# EAGLE design 7474-strobe-generator-v2 (EAGLE 9.4.2)
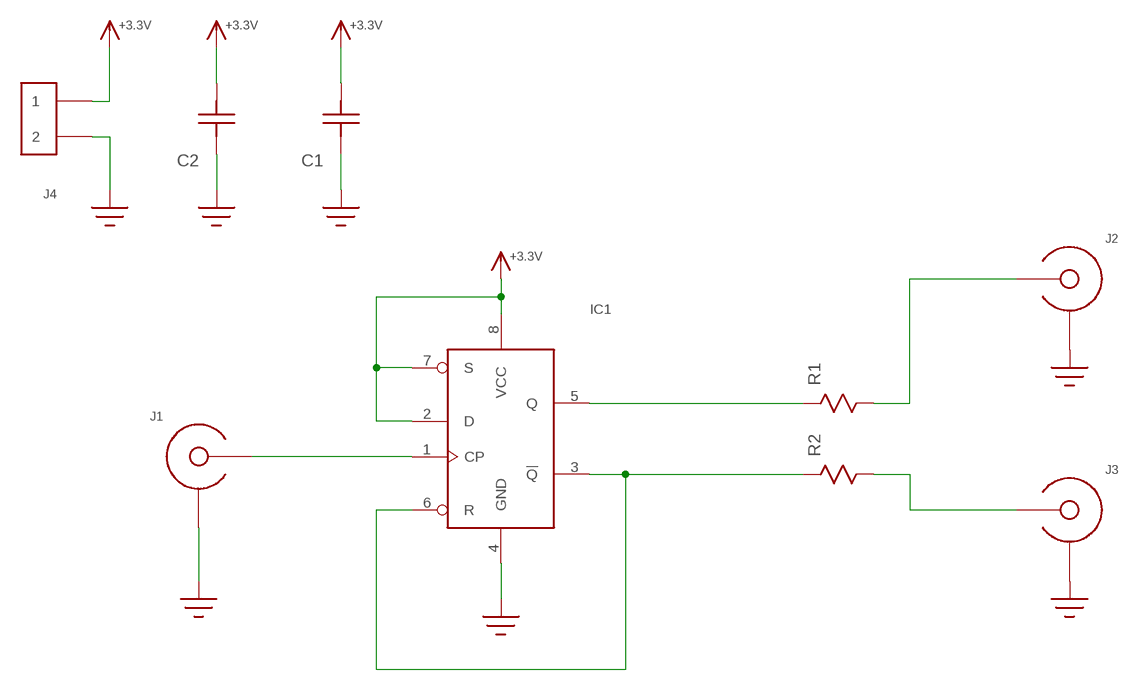
[diagram p0: schematic, sheet 1]

## Parts
C1  C0603  [C0603]
C2  C1206  [1206]
IC1  74LVC2G74  [SSOP8]
J1  SMA-EDGE-LAUNCH4020_TAPER  [SMA_EDGE_LAUNCH_2L_4020_TAPER]
J2  SMA-EDGE-LAUNCH4020_TAPER  [SMA_EDGE_LAUNCH_2L_4020_TAPER]
J3  SMA-EDGE-LAUNCH4020_TAPER  [SMA_EDGE_LAUNCH_2L_4020_TAPER]
J4  HEADER_2PIN  [HEADER_2PIN]
R1  R0603  [R0603]
R2  R0603  [R0603]

## Nets
+3.3V: C1.P$1 C2.P$1 IC1.2(D) IC1.7(S) IC1.8(VCC) J4.1
GND: C1.P$2 C2.P$2 IC1.4(GND) J1.BOTTOM_GND(SHIELD) J1.GND@1(SHIELD) J1.GND@2(SHIELD) J1.GND@3(SHIELD) J1.GND@4(SHIELD) J1.GND@5(SHIELD) J1.GND@6(SHIELD) J1.GND@7(SHIELD) J1.GND@8(SHIELD) J1.GND@14(SHIELD) J1.GND@15(SHIELD) J1.GND@16(SHIELD) J1.GND@17(SHIELD) J1.GND_PAD1(SHIELD) J1.GND_PAD2(SHIELD) J1.P$1(SHIELD) J1.P$2(SHIELD) J2.BOTTOM_GND(SHIELD) J2.GND@1(SHIELD) J2.GND@2(SHIELD) J2.GND@3(SHIELD) J2.GND@4(SHIELD) J2.GND@5(SHIELD) J2.GND@6(SHIELD) J2.GND@7(SHIELD) J2.GND@8(SHIELD) J2.GND@14(SHIELD) J2.GND@15(SHIELD) J2.GND@16(SHIELD) J2.GND@17(SHIELD) J2.GND_PAD1(SHIELD) J2.GND_PAD2(SHIELD) J2.P$1(SHIELD) J2.P$2(SHIELD) J3.BOTTOM_GND(SHIELD) J3.GND@1(SHIELD) J3.GND@2(SHIELD) J3.GND@3(SHIELD) J3.GND@4(SHIELD) J3.GND@5(SHIELD) J3.GND@6(SHIELD) J3.GND@7(SHIELD) J3.GND@8(SHIELD) J3.GND@14(SHIELD) J3.GND@15(SHIELD) J3.GND@16(SHIELD) J3.GND@17(SHIELD) J3.GND_PAD1(SHIELD) J3.GND_PAD2(SHIELD) J3.P$1(SHIELD) J3.P$2(SHIELD) J4.2
N$1 [29-6]: IC1.1(CP) J1.CENTER@1(CENTER)
N$2: IC1.3(!Q!) IC1.6(R) R2.P$1
N$3 [29-6]: J2.CENTER@1(CENTER) R1.P$2
N$4: IC1.5(Q) R1.P$1
N$5 [29-6]: J3.CENTER@1(CENTER) R2.P$2

## Library data of the parts
C1 C2 = yapo:C
IC1 = yapo:74LVC2G74
J1-J3 = yapo:SMA-EDGE-LAUNCH
J4 = yapo:HEADER_2PIN
R1 R2 = yapo:R

## Net classes
1 29-6: width 0.737 mm, clearance 0.152 mm

## Board
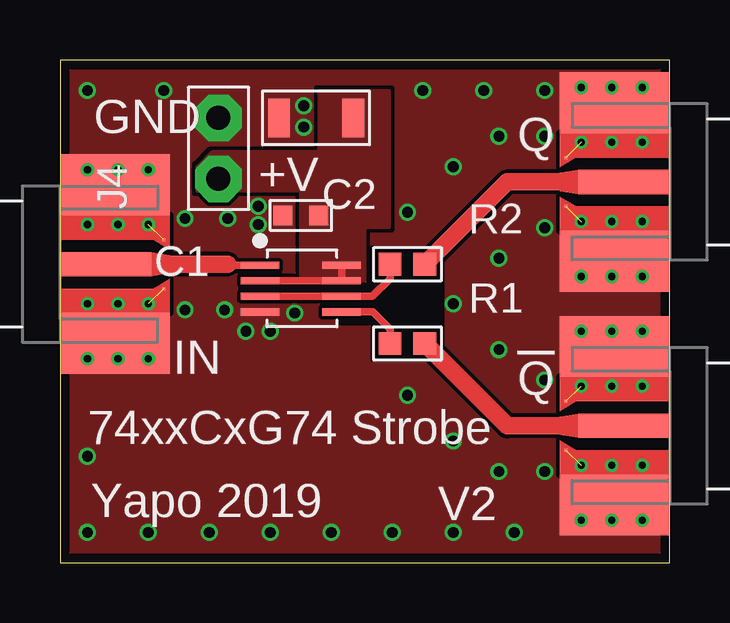
[diagram p1: board, top side]
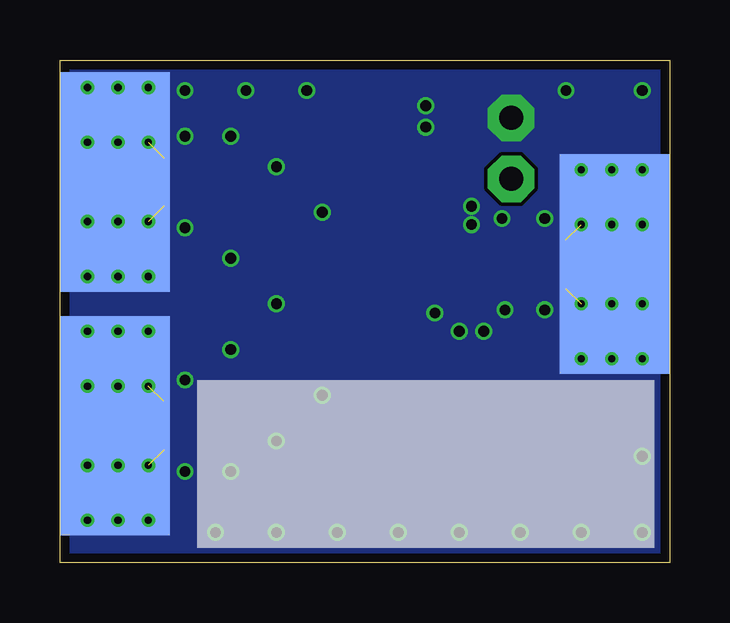
[diagram p2: board, bottom side, seen from below]

Size 25.4 x 20.95 mm. Coordinates in mm from the lower left corner, seen from the top.
Outline: 0,0 25.4,0 25.4,20.95 0,20.95 0,0
Copper layers (1*16): Top 0.035559375mm / dielectric 1.6mm / Bottom 0.035559375mm
Design rules "oshpark-2layer *": minimum track width 6mil, minimum drill 10mil, track to track 6mil, track to pad 6mil, pad to pad 6mil, via to via 6mil, smd to smd 6mil, copper to edge 15mil, drill to drill 6mil, minimum pad ring 5mil, minimum via ring 5mil, stop-mask expansion 2.5mil, vias tented up to drill 20mil, thermal gap 10mil

### Footprints (pad centres in the part's own frame; a part is rotated, then mirrored left to right if it is on the bottom)
C0603 = smd 0.8 x 0.8: P$1 -0.75,0; P$2 0.75,0
1206 = smd 0.9 x 1.6: P$1 -1.55,0; P$2 1.55,0
SSOP8 = smd 0.3 x 1.6: 1 -0.975,-1.7; 2 -0.325,-1.7; 3 0.325,-1.7; 4 0.975,-1.7; 5 0.975,1.7; 6 0.325,1.7; 7 -0.325,1.7; 8 -0.975,1.7
SMA_EDGE_LAUNCH_2L_4020_TAPER = smd 4.572 x 9.144 bottom: BOTTOM_GND 2.286,0 | smd 3.81 x 1.016: CENTER@1 1.905,0 | drill 0.3: GND@1 1.143,3.937; GND@2 3.683,3.937; GND@3 1.143,1.651; GND@4 3.683,1.651; GND@5 1.143,-1.651; GND@6 3.683,-1.651; GND@7 1.143,-3.937; GND@8 3.683,-3.937; GND@14 2.413,3.937; GND@15 2.413,-3.937; GND@16 2.413,-1.651; GND@17 2.413,1.651 | smd 4.572 x 2.54: GND_PAD1 2.286,3.302; GND_PAD2 2.286,-3.302 | smd 0.127 x 0.127: P$1 4.318,1.016; P$2 4.318,-1.016
HEADER_2PIN = drill 1 pad 1.93 octagon: 1 -1.27,0; 2 1.27,0
R0603 = smd 0.95 x 0.95: P$1 -0.725,0; P$2 0.725,0

### Placement (x,y rotation side)
C1  10.03,14.48 180 top
C2  10.67,18.54 180 top
IC1  10.03,11.43 270 top
J1  0,12.45 0 top
J2  25.4,5.71 180 top
J3  25.4,15.88 180 top
J4  6.6,17.27 90 top
R1  14.48,9.14 0 top
R2  14.48,12.45 0 top

### Tracks (layer width: path | path; a pad name or v marks a point on that pad's centre or on a via)
+3.3V
  Top 0.305: IC1.2 IC1.7 IC1.8
  pour Top (no thermals): 6.35,17.14 10.79,17.14 10.79,19.68 13.72,19.68 13.72,13.97 12.7,13.97 12.7,11.68 10.03,11.68 10.03,15.49 5.71,15.49 5.71,16.51
GND  (via drill 0.45)  (6 unrouted)
  other vias: 8.26,14.86 8.26,14.1 9.78,10.41 6.86,10.54 7.75,9.65 8.76,9.65 5.21,14.35 5.21,10.54 6.99,14.35 20.19,17.78 20.19,13.97 18.29,17.78 18.29,12.7 16.38,16.51 14.48,14.61 16.38,10.79 20.19,7.62 20.19,3.81 18.29,3.81 18.29,8.89 16.38,5.08 14.48,6.99 1.14,19.68 4.32,19.68 1.14,1.27 1.14,4.45 3.68,1.27 6.22,1.27 8.76,1.27 11.3,1.27 13.84,1.27 16.38,1.27 18.92,1.27 20.19,19.68 17.65,19.68 15.11,19.68 10.16,19.05 10.16,18.16
  pour Bottom (rank 2, no thermals): 0,0 0,20.95 25.4,20.95 25.4,0
  pour Top (rank 2, no thermals): 0,0 0,20.95 25.4,20.95 25.4,0
  cutout Top: 12.95,13.21 16,13.21 16,11.68 12.95,11.68
  cutout Top: 12.95,9.91 16,9.91 16,8.38 12.95,8.38
  cutout Top: 11.56,11.68 11.56,9.91 16,9.91 16,11.68
N$1
  Top 0.305: IC1.1 7.03,12.4 6.99,12.45
  Top 0.737: 6.99,12.45 J1.CENTER@1
N$2
  Top 0.305: IC1.3 IC1.6 13.01,11.11 13.75,11.85 R2.P$1
N$3
  Top 0.737: J2.CENTER@1 18.63,5.71 R1.P$2
N$4
  Top 0.305: IC1.5 13.04,10.46 13.75,9.74 R1.P$1
N$5
  Top 0.737: J3.CENTER@1 18.63,15.88 R2.P$2

### Text on the board
tPlace: GND | Q | +V | IN | !Q! | 74xxCxG74 Strobe | Yapo 2019 | V2